# Altium project LVGBufAmp.PRJPCB
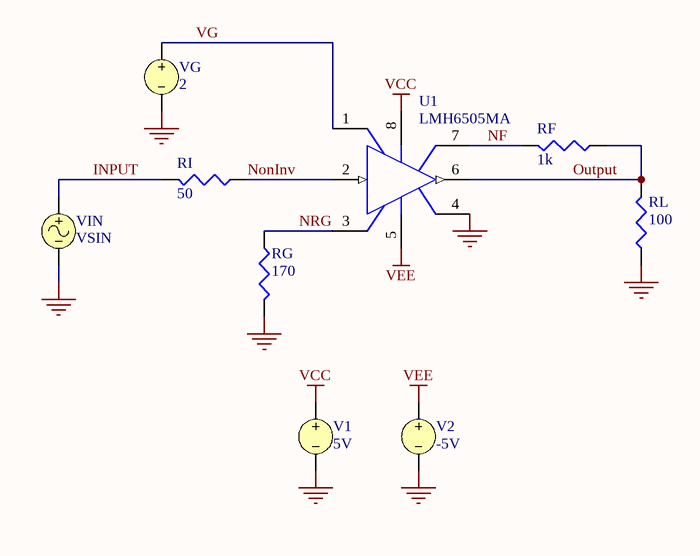
[diagram p0: LVGBufAmp.schdoc]
1 sheet, 9 parts. Net scope: global (net labels, ports and power ports of the same name join across sheets).

## Sheet LVGBufAmp.schdoc: Analog Amplifier
size A4; Organization: Altium Limited; Address1: L3, 12a Rodborough Rd; Address2: Frenchs Forest; Address3: NSW; Address4: Australia 2086; DocumentNumber: 1; SheetNumber: 1; SheetTotal: 1

### Parts
RF  value 1k  (hidden comment: 100k)
RG  value 170  (hidden comment: 10k)
RI  value 50  (hidden comment: 10k)
RL  value 100  (hidden comment: 25k)
U1  LMH6505MA  [M08A_N]
V1  value 5V  (hidden comment: 12V)
V2  value -5V  (hidden comment: -12V)
VG  value 2  (hidden comment: 12V)
VIN  VSIN

### Nets
GND: RG.1(TOP) RL.2(BOT) U1.4(GND) V1.2 V2.2 VG.2 VIN.2
VCC: U1.8(V+) V1.1
VEE: U1.5(V-) V2.1
INPUT: RI.1(TOP) VIN.1
NF: RF.1(TOP) U1.7(I-)
NonInv: RI.2(BOT) U1.2(VIN)
NRG: RG.2(BOT) U1.3(RG)
Output: RF.2(BOT) RL.1(TOP) U1.6(VOUT)
VG: U1.1(VG) VG.1

### Notes on the sheet
- Title
- Size:
- Date:
- A4
- Number:
- Time:
- Revision:
- Sheet
- of
- File:

### Library data of the parts
RF RG RI RL = RES: Resistor
U1 = LMH6505MA: Wideband, Low Power, Linear-in-dB, Variable Gain Amplifier; Manufacturer: National Semiconductor; CompType: Amplifiers; PackageTopMarking: NSZXTT*LMH65*05MA; DeviceFunction: Buffer Amplifier; Published: 4-Dec-2008; DatasheetVersion: Dec-2007; PackageVersion: revL, Sep-2006; PackageReference: M08A; Publisher: Altium Limited; PackageDescription: SOIC Narrow, 4.9 x 3.9 x 1.45mm, 8 Lead, 1.27mm Pitch; PartNumber: LMH6505MA; RoHS: Y; PinCount: 8; DigiKeyPartNumber: LMH6505MA-ND; Code_JEDEC: MS-012-AA; Code_IPC: SOIC127P600-8; ComponentLink1Description: LMH6505 Datasheet; ComponentLink1URL: http://www.national.com/ds/LM/LMH6505.pdf; ComponentLink2Description: LMH6505 Web Page; ComponentLink2URL: http://www.national.com/pf/LM/LMH6505.html; ComponentLink3Description: M08A Package Page; ComponentLink3URL: http://www.national.com/packaging/folders/m08a.html
V1 V2 VG = VSRC: Voltage Source
VIN = VSIN: Sinusoidal Voltage Source